# Altium schematic sheet RS485_ADM3485.SchDoc
size 381 x 241 mm; SheetNumber: 7; SheetTotal: 7
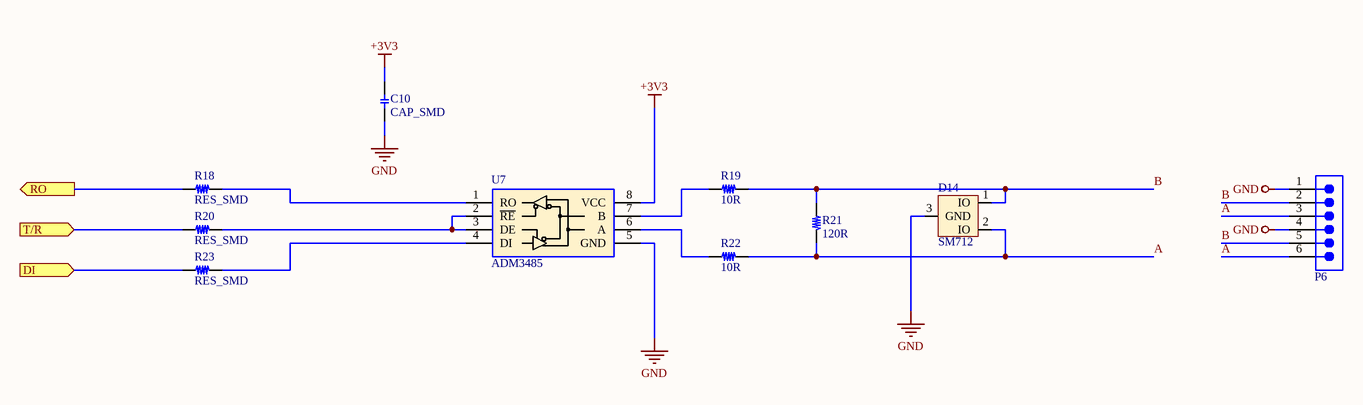
[diagram p0: RS485_ADM3485.SchDoc]

## Parts
C10  CAP_SMD  [C 0603]
D14  SM712  [SOT-23_3_D]
P6  691321300006  [691321300006]  (value not drawn)
R18  RES_SMD  [R 0603]
R19  10R  [R 1206]
R20  RES_SMD  [R 0603]
R21  120R  [R 1206]
R22  10R  [R 1206]
R23  RES_SMD  [R 0603]
U7  ADM3485  [SOIC-8]

## Ports
DI (in), RO (out), T/R (in)

## Nets
+3V3: C10.2 U7.8(VCC)
GND: C10.1 D14.3(GND) P6.1 P6.4 U7.5(GND)
A: D14.2(IO) P6.3 P6.6 R21.2 R22.2
B: D14.1(IO) P6.2 P6.5 R19.2 R21.1
DI: R23.1 ; port DI
RO: R18.1 ; port RO
T/R: R20.1 ; port T/R
NetR18_2: R18.2 U7.1(RO)
NetR19_1: R19.1 U7.7(B)
NetR20_2: R20.2 U7.2(~{RE}) U7.3(DE)
NetR22_1: R22.1 U7.6(A)
NetR23_2: R23.2 U7.4(DI)

## Library data of the parts
P6 = 691321300006: WR-TBL Series 321 Vertical PCB Header, Through Hole, pitch 3.81mm, 6p; Manufacturer: Wurth Elektronik; Pin Number: 6; Rated Current: 10A; Working Voltage: 300V; Modularity: No; ComponentLink1Description: Manufacturer Link; ComponentLink1URL: https://www.we-online.com/redexpert/article/691321300006?ad; ComponentLink2Description: Datasheet; ComponentLink2URL: https://www.we-online.com/redexpert/spec/691321300006?ad; Category: Terminal Blocks; Match Code: WR-TBL; Manufacturer Part Number: 691321300006; Mount: Through Hole; Operating Temperature Max: 105°C; Operating Temperature Min: -40°C; Packaging: Box; Pitch: 3.81mm; Orientation: Vertical; Application: Pluggable; PCB/Cable/Panel: PCB
R19 R21 R22 = RES_SMD